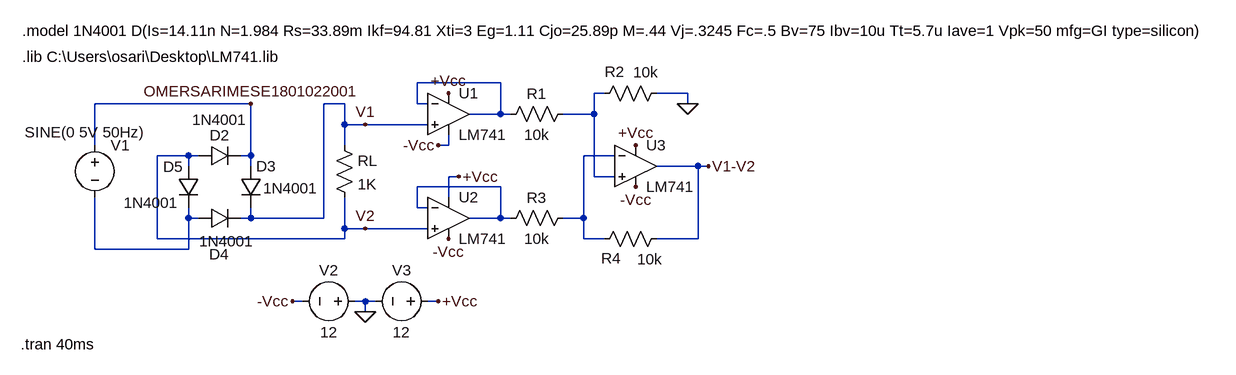
[diagram p0: schematic deneme1.asc]
deneme1.asc, the LTspice schematic file:
Version 4
SHEET 1 1800 680
WIRE 496 -256 368 -256
WIRE 656 -240 640 -240
WIRE 784 -240 736 -240
WIRE 112 -224 -128 -224
WIRE 256 -224 224 -224
WIRE 368 -224 368 -256
WIRE 384 -224 368 -224
WIRE 784 -224 784 -240
WIRE 496 -208 496 -256
WIRE 496 -208 448 -208
WIRE 512 -208 496 -208
WIRE 640 -208 640 -240
WIRE 640 -208 592 -208
WIRE 256 -192 256 -224
WIRE 288 -192 256 -192
WIRE 384 -192 288 -192
WIRE -128 -160 -128 -224
WIRE 256 -160 256 -192
WIRE 416 -160 416 -176
WIRE 416 -160 400 -160
WIRE 16 -144 -32 -144
WIRE 32 -144 16 -144
WIRE 112 -144 112 -224
WIRE 112 -144 96 -144
WIRE 672 -144 624 -144
WIRE 16 -128 16 -144
WIRE 112 -128 112 -144
WIRE 800 -128 736 -128
WIRE 816 -128 800 -128
WIRE 432 -112 416 -112
WIRE 640 -112 640 -208
WIRE 672 -112 640 -112
WIRE 496 -96 368 -96
WIRE 416 -80 416 -112
WIRE 368 -64 368 -96
WIRE 384 -64 368 -64
WIRE 16 -48 16 -64
WIRE 32 -48 16 -48
WIRE 112 -48 112 -64
WIRE 112 -48 96 -48
WIRE 224 -48 224 -224
WIRE 224 -48 112 -48
WIRE 496 -48 496 -96
WIRE 496 -48 448 -48
WIRE 512 -48 496 -48
WIRE 624 -48 624 -144
WIRE 624 -48 592 -48
WIRE 256 -32 256 -80
WIRE 288 -32 256 -32
WIRE 384 -32 288 -32
WIRE -32 -16 -32 -144
WIRE 256 -16 256 -32
WIRE 256 -16 -32 -16
WIRE 624 -16 624 -48
WIRE 656 -16 624 -16
WIRE 800 -16 800 -128
WIRE 800 -16 736 -16
WIRE -128 0 -128 -80
WIRE 16 0 16 -48
WIRE 16 0 -128 0
WIRE 192 80 176 80
WIRE 288 80 272 80
WIRE 304 80 288 80
WIRE 400 80 384 80
WIRE 288 96 288 80
FLAG 784 -224 0
FLAG 816 -128 V1-V2
FLAG 288 -192 V1
FLAG 288 -32 V2
FLAG 288 96 0
FLAG 400 80 +Vcc
FLAG 176 80 -Vcc
FLAG 416 -240 +Vcc
FLAG 704 -160 +Vcc
FLAG 432 -112 +Vcc
FLAG 416 -16 -Vcc
FLAG 704 -96 -Vcc
FLAG 400 -160 -Vcc
FLAG 112 -224 OMERSARIMESE1801022001
SYMBOL diode 32 -128 R270
WINDOW 0 32 32 VTop 2
WINDOW 3 -41 -73 VBottom 2
SYMATTR InstName D2
SYMATTR Value 1N4001
SYMBOL diode 96 -128 R0
WINDOW 3 35 34 Left 2
SYMATTR Value 1N4001
SYMATTR InstName D3
SYMBOL diode 32 -32 R270
WINDOW 0 -55 31 VTop 2
WINDOW 3 -4 43 VBottom 2
SYMATTR InstName D4
SYMATTR Value 1N4001
SYMBOL diode 0 -128 R0
WINDOW 0 -23 1 Left 2
WINDOW 3 22 -71 Left 2
SYMATTR InstName D5
SYMATTR Value 1N4001
SYMBOL res 240 -176 R0
SYMATTR InstName RL
SYMATTR Value 1K
SYMATTR SpiceLine tol=1 pwr=0.1
SYMBOL voltage -128 -176 R0
WINDOW 3 -108 -4 Left 2
WINDOW 123 0 0 Left 0
WINDOW 39 0 0 Left 0
SYMATTR InstName V1
SYMATTR Value SINE(0 5V 50Hz)
SYMBOL OpAmps\\opamp2 416 -272 R0
SYMATTR InstName U1
SYMATTR Value LM741
SYMBOL OpAmps\\opamp2 416 -112 R0
SYMATTR InstName U2
SYMATTR Value LM741
SYMBOL OpAmps\\opamp2 704 -192 R0
SYMATTR InstName U3
SYMATTR Value LM741
SYMBOL res 608 -224 R90
WINDOW 0 0 56 VBottom 2
WINDOW 3 32 56 VTop 2
SYMATTR InstName R1
SYMATTR Value 10k
SYMBOL res 752 -256 R90
WINDOW 0 -2 80 VBottom 2
WINDOW 3 -32 32 VTop 2
SYMATTR InstName R2
SYMATTR Value 10k
SYMBOL res 608 -64 R90
WINDOW 0 0 56 VBottom 2
WINDOW 3 32 56 VTop 2
SYMATTR InstName R3
SYMATTR Value 10k
SYMBOL res 640 0 R270
WINDOW 0 -29 26 VTop 2
WINDOW 3 0 86 VBottom 2
SYMATTR InstName R4
SYMATTR Value 10k
SYMBOL voltage 288 80 R90
WINDOW 0 -32 56 VBottom 2
WINDOW 3 32 56 VTop 2
WINDOW 123 0 0 Left 0
WINDOW 39 0 0 Left 0
SYMATTR InstName V2
SYMATTR Value 12
SYMBOL voltage 400 80 R90
WINDOW 0 -32 56 VBottom 2
WINDOW 3 32 56 VTop 2
WINDOW 123 0 0 Left 0
WINDOW 39 0 0 Left 0
SYMATTR InstName V3
SYMATTR Value 12
TEXT -240 -336 Left 2 !.model 1N4001 D(Is=14.11n N=1.984 Rs=33.89m Ikf=94.81 Xti=3 Eg=1.11 Cjo=25.89p M=.44 Vj=.3245 Fc=.5 Bv=75 Ibv=10u Tt=5.7u Iave=1 Vpk=50 mfg=GI type=silicon)
TEXT -240 -296 Left 2 !.lib C:\\Users\\osari\\Desktop\\LM741.lib
TEXT -242 146 Left 2 !.tran 40ms

The netlist it stands for:
* deneme1.asc
D2 V2 OMERSARIMESE1801022001 1N4001
D3 OMERSARIMESE1801022001 V1 1N4001
D4 N005 V1 1N4001
D5 V2 N005 1N4001
RL V1 V2 1K tol=1 pwr=0.1
V1 OMERSARIMESE1801022001 N005 SINE(0 5V 50Hz)
XU1 V1 N001 +Vcc -Vcc N001 LM741  ; pins In+ In- V+ V- OUT
XU2 V2 N004 +Vcc -Vcc N004 LM741  ; pins In+ In- V+ V- OUT
XU3 N002 N003 +Vcc -Vcc V1-V2 LM741  ; pins In+ In- V+ V- OUT
R1 N002 N001 10k
R2 0 N002 10k
R3 N003 N004 10k
R4 N003 V1-V2 10k
V2 0 -Vcc 12
V3 +Vcc 0 12
.model D D
.lib standard.dio
.model 1N4001 D(Is=14.11n N=1.984 Rs=33.89m Ikf=94.81 Xti=3 Eg=1.11 Cjo=25.89p M=.44 Vj=.3245 Fc=.5 Bv=75 Ibv=10u Tt=5.7u Iave=1 Vpk=50 mfg=GI type=silicon)
.lib C:\Users\osari\Desktop\LM741.lib
.tran 40ms
.backanno
.end